# EAGLE design usv_50w_board (EAGLE 8.4.2)
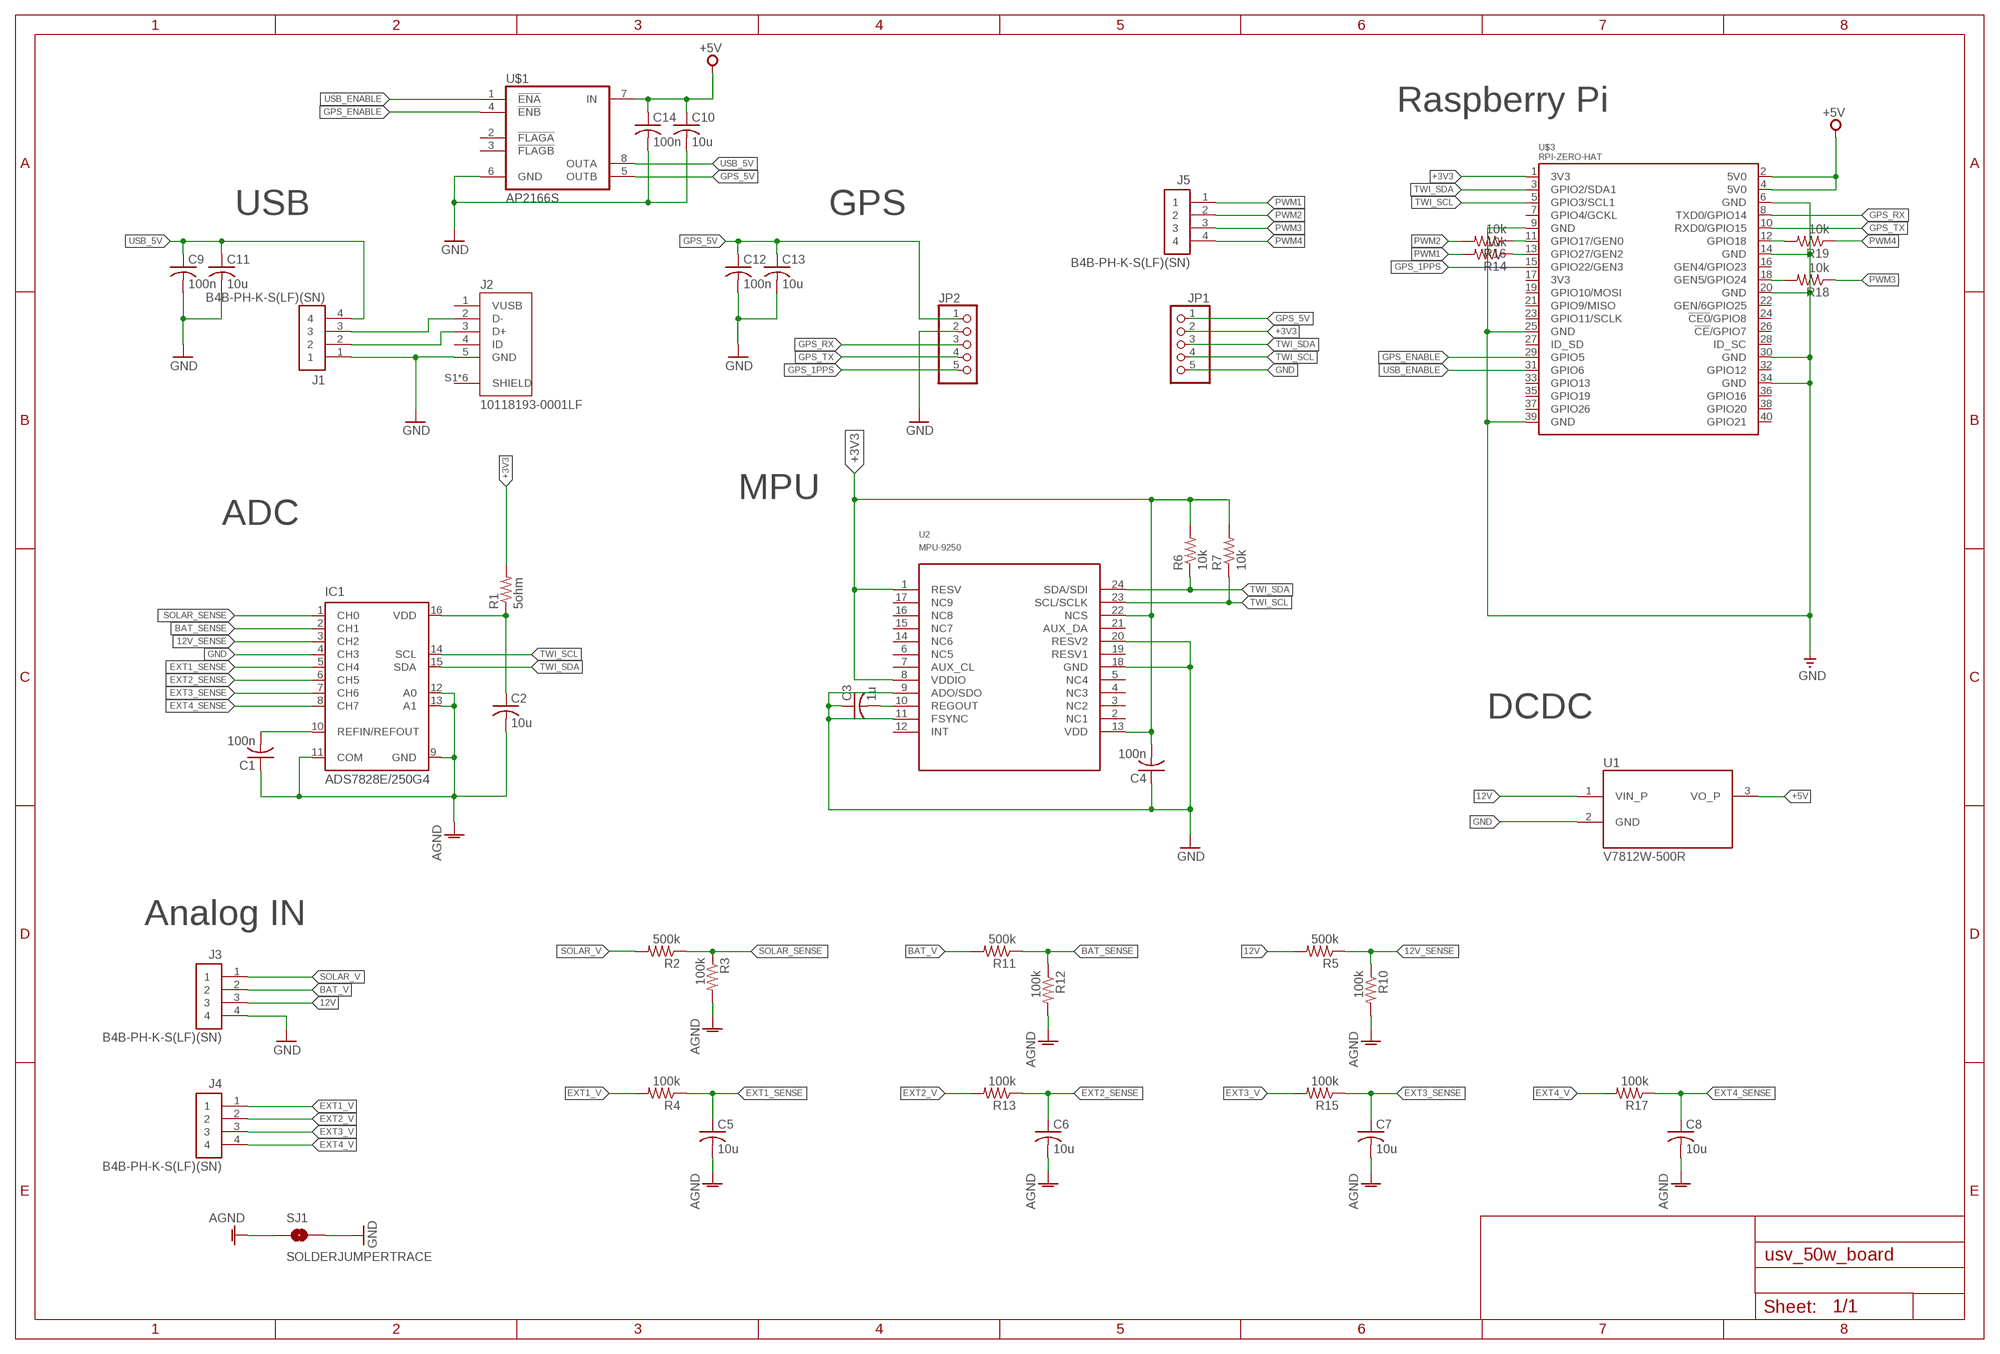
[diagram p0: schematic, sheet 1]

## Parts
C1  100n  C-USC0603  [C0603]
C2  10u  C-USC0603  [C0603]
C3  1u  C-USC0603  [C0603]
C4  100n  C-USC0603  [C0603]
C5  10u  C-USC0603  [C0603]
C6  10u  C-USC0603  [C0603]
C7  10u  C-USC0603  [C0603]
C8  10u  C-USC0603  [C0603]
C9  100n  C-USC0603  [C0603]
C10  10u  C-USC0603  [C0603]
C11  10u  C-USC0603  [C0603]
C12  100n  C-USC0603  [C0603]
C13  10u  C-USC0603  [C0603]
C14  100n  C-USC0603  [C0603]
IC1  ADS7828E/250G4  [TSSOP16-PW]
J1  B4B-PH-K-S(LF)(SN)  [JST_B4B-PH-K-S(LF)(SN)]
J2  10118193-0001LF  [FCI_10118193-0001LF]
J3  B4B-PH-K-S(LF)(SN)  [JST_B4B-PH-K-S(LF)(SN)]
J4  B4B-PH-K-S(LF)(SN)  [JST_B4B-PH-K-S(LF)(SN)]
J5  B4B-PH-K-S(LF)(SN)  [JST_B4B-PH-K-S(LF)(SN)]
JP1  PINHD-1X5  [1X05]
JP2  PINHD-1X5  [1X05]
R1  5ohm  R-US_R0603  [R0603]
R2  500k  R-US_R0603  [R0603]
R3  100k  R-US_R0603  [R0603]
R4  100k  R-US_R0603  [R0603]
R5  500k  R-US_R0603  [R0603]
R6  10k  R-US_R0603  [R0603]
R7  10k  R-US_R0603  [R0603]
R10  100k  R-US_R0603  [R0603]
R11  500k  R-US_R0603  [R0603]
R12  100k  R-US_R0603  [R0603]
R13  100k  R-US_R0603  [R0603]
R14  10k  R-US_R0603  [R0603]
R15  100k  R-US_R0603  [R0603]
R16  10k  R-US_R0603  [R0603]
R17  100k  R-US_R0603  [R0603]
R18  10k  R-US_R0603  [R0603]
R19  10k  R-US_R0603  [R0603]
SJ1  SOLDERJUMPERTRACE  [SJ_2S-TRACE]
U1  V7812W-500R  [CONV_V7812W-500R]
U2  MPU-9250  [LEAD-QFN24]
U$1  AP2166S  [SO08]
U$3  RPI-ZERO-HAT  [RASP_PI_ZERO_BOARD_FULL]

## Nets
12V: J3.3 R5.2 U1.1(VIN_P)
12V_SENSE: IC1.3(CH2) R5.1 R10.1
+3V3: C4.2 JP1.2 R1.2 R6.2 R7.2 U2.1(RESV) U2.8(VDDIO) U2.13(VDD) U2.22(NCS) U$3.1(3V3)
+5V [VCC]: C10.1 C14.1 U1.3(VO_P) U$1.7(IN) U$3.2(5V0) U$3.4(5V0)
AGND [GND]: C1.1 C2.2 C5.2 C6.2 C7.2 C8.2 IC1.9(GND) IC1.11(COM) IC1.12(A0) IC1.13(A1) R3.2 R10.2 R12.2 SJ1.1
BAT_SENSE: IC1.2(CH1) R11.1 R12.1
BAT_V: J3.2 R11.2
D_N: J1.3 J2.2(D-)
D_P: J1.2 J2.3(D+)
EXT1_SENSE: C5.1 IC1.5(CH4) R4.1
EXT1_V: J4.1 R4.2
EXT2_SENSE: C6.1 IC1.6(CH5) R13.1
EXT2_V: J4.2 R13.2
EXT3_SENSE: C7.1 IC1.7(CH6) R15.1
EXT3_V: J4.3 R15.2
EXT4_SENSE: C8.1 IC1.8(CH7) R17.1
EXT4_V: J4.4 R17.2
GND [GND]: C3.1 C4.1 C9.2 C10.2 C11.2 C12.2 C13.2 C14.2 IC1.4(CH3) J1.1 J2.5(GND) J3.4 JP1.5 JP2.2 SJ1.2 U1.2(GND) U2.9(ADO/SDO) U2.11(FSYNC) U2.18(GND) U2.20(RESV2) U$1.6(GND) U$3.6(GND) U$3.9(GND) U$3.14(GND) U$3.20(GND) U$3.25(GND) U$3.30(GND) U$3.34(GND) U$3.39(GND)
GPS_1PPS: JP2.5 U$3.15(GPIO22/GEN3)
GPS_5V [VCC]: C12.1 C13.1 JP1.1 JP2.1 U$1.5(OUTB)
GPS_ENABLE: U$1.4(!ENB!) U$3.29(GPIO5)
GPS_RX: JP2.3 U$3.8(TXD0/GPIO14)
GPS_TX: JP2.4 U$3.10(RXD0/GPIO15)
N$3: R14.1 U$3.13(GPIO27/GEN2)
N$4: C3.2 U2.10(REGOUT)
N$5: R16.1 U$3.11(GPIO17/GEN0)
N$6: R18.2 U$3.18(GEN5/GPIO24)
N$7: R19.2 U$3.12(GPIO18)
N$11: C2.1 IC1.16(VDD) R1.1
N$12: C1.2 IC1.10(REFIN/REFOUT)
PWM1: J5.1 R14.2
PWM2: J5.2 R16.2
PWM3: J5.3 R18.1
PWM4: J5.4 R19.1
SOLAR_SENSE: IC1.1(CH0) R2.1 R3.1
SOLAR_V: J3.1 R2.2
TWI_SCL: IC1.14(SCL) JP1.4 R7.1 U2.23(SCL/SCLK) U$3.5(GPIO3/SCL1)
TWI_SDA: IC1.15(SDA) JP1.3 R6.1 U2.24(SDA/SDI) U$3.3(GPIO2/SDA1)
USB_5V: C9.1 C11.1 J1.4 U$1.8(OUTA)
USB_ENABLE: U$1.1(!ENA!) U$3.31(GPIO6)
Unconnected: J2.1(VUSB) J2.4(ID) J2.S1(SHIELD) J2.S2(SHIELD) J2.S3(SHIELD) J2.S4(SHIELD) J2.S5(SHIELD) J2.S6(SHIELD) U2.2(NC1) U2.3(NC2) U2.4(NC3) U2.5(NC4) U2.6(NC5) U2.7(AUX_CL) U2.12(INT) U2.14(NC6) U2.15(NC7) U2.16(NC8) U2.17(NC9) U2.19(RESV1) U2.21(AUX_DA) U$1.2(!FLAGA!) U$1.3(!FLAGB!) U$3.7(GPIO4/GCKL) U$3.16(GEN4/GPIO23) U$3.17(3V3) U$3.19(GPIO10/MOSI) U$3.21(GPIO9/MISO) U$3.22(GEN/6GPIO25) U$3.23(GPIO11/SCLK) U$3.24(!CE0!/GPIO8) U$3.26(!CE!/GPIO7) U$3.27(ID_SD) U$3.28(ID_SC) U$3.32(GPIO12) U$3.33(GPIO13) U$3.35(GPIO19) U$3.36(GPIO16) U$3.37(GPIO26) U$3.38(GPIO20) U$3.40(GPIO21)

## Notes on the sheet
- Raspberry Pi
- USB | GPS | GPS
- MPU
- ADC
- DCDC
- Analog IN
- Hole

## Library data of the parts
C1-C14 = resistor:C-US: CAPACITOR, American symbol
IC1 = ADS7828E_250G4:ADS7828E/250G4: 12-Bit, 8-Channel Sampling ANALOG-TO-DIGITAL CONVERTER with I2C? Interface Source: www.ti.com .. ADS7828E/250G4.pdf; AVAILABILITY: Unavailable; DESCRIPTION: 12-Bit, 8-Channel SAR ADC with Internal Reference and I2C Interface 16-TSSOP -40 to 85; MF: Texas Instruments; MP: ADS7828E/250G4; PACKAGE: TSSOP-16 Texas Instruments; PRICE: None
J1 J3-J5 = B4B-PH-K-S_LF__SN_:B4B-PH-K-S(LF)(SN): PH Series 4 Position 2 mm Pitch Through Hole Crimp Top Entry Shrouded Header; DESCRIPTION: PH Series 4 Position 2 mm Pitch Through Hole Crimp Top Entry Shrouded Header; DIGI-KEY_PART_NUMBER: 455-1706-ND; DIGI-KEY_PURCHASE_URL: https://www.digikey.jp/product-detail/en/jst-sales-america-inc/B4B-PH-K-S_LF__SN_/455-1706-ND/926613?utm_source=snapeda&utm_medium=aggregator&utm_campaign=symbol; MF: JST Sales; MP: B4B-PH-K-S_LF__SN_; PACKAGE: None
J2 = 10118193-0001LF:10118193-0001LF: Micro USB B Type Receptacle; AVAILABILITY: Unavailable; DESCRIPTION: Single Port 5 Contact Shielded SMT MICRO USB B-Type Receptacle; MF: Amphenol FCI; MP: 10118193-0001LF; PACKAGE: None; PRICE: None
JP1 JP2 = pinhead+:PINHD-1X5: PIN HEADER
R1-R7 R10-R19 = resistor:R-US_: RESISTOR, American symbol
SJ1 = SparkFun-Retired:SOLDERJUMPER: Solder Jumper Standard SMD solder jumper. Used to automate production. Two varients : Normally Open and Normally Closed are the same, but have different paste layers. NC will have a large amount of paste and should jumper during reflow.
U1 = V7812W-500R:V7812W-500R; AVAILABILITY: Unavailable; CUI_PURCHASE_URL: https://www.cui.com/product/power/dc-dc-converters/non-isolated/0.5-a-output-current/v78w-500r-series?utm_source=snapeda.com&utm_medium=referral&utm_campaign=snapedaBOM; DESCRIPTION: V78W-500R Series 12 V 0.5 A Single Output Non-Isolated Switching Regulator; MF: CUI Inc.; MP: V7812W-500R; PACKAGE: SIP-3 CUI; PRICE: None
U2 = invensense:MPU-9250
U$1 = diodes-inc:AP2166: USB POWER SWITCH 1A DUAL CHANNEL CURRENT-LIMITED POWER SWITCH
U$3 = raspberrypi-zero:RPI-ZERO-HAT

## Net classes
1 GND: width 0.508 mm, drill 0.3 mm, clearance 0.2 mm to class 0, clearance 0.2 mm
2 100ohm_differencial_pair: width 0.254 mm, drill 0.3 mm, clearance 0.5 mm to class 0, clearance 0.5 mm to class 1, clearance 0.25 mm
3 90ohm_differencial_pair: width 0.254 mm, drill 0.3 mm, clearance 0.5 mm to class 0, clearance 0.5 mm to class 1, clearance 0.5 mm to class 2, clearance 0.15 mm
4 AGND: width 0.254 mm, drill 0.3 mm, clearance 0.5 mm to class 0, clearance 0.5 mm to class 1, clearance 0.5 mm to class 2, clearance 0.5 mm to class 3, clearance 0.5 mm
5 VCC: width 0.508 mm, drill 0.3 mm, clearance 0.3 mm to class 0, clearance 0.3 mm to class 1, clearance 0.5 mm to class 2, clearance 0.5 mm to class 3, clearance 0.5 mm to class 4, clearance 0.3 mm

## Board
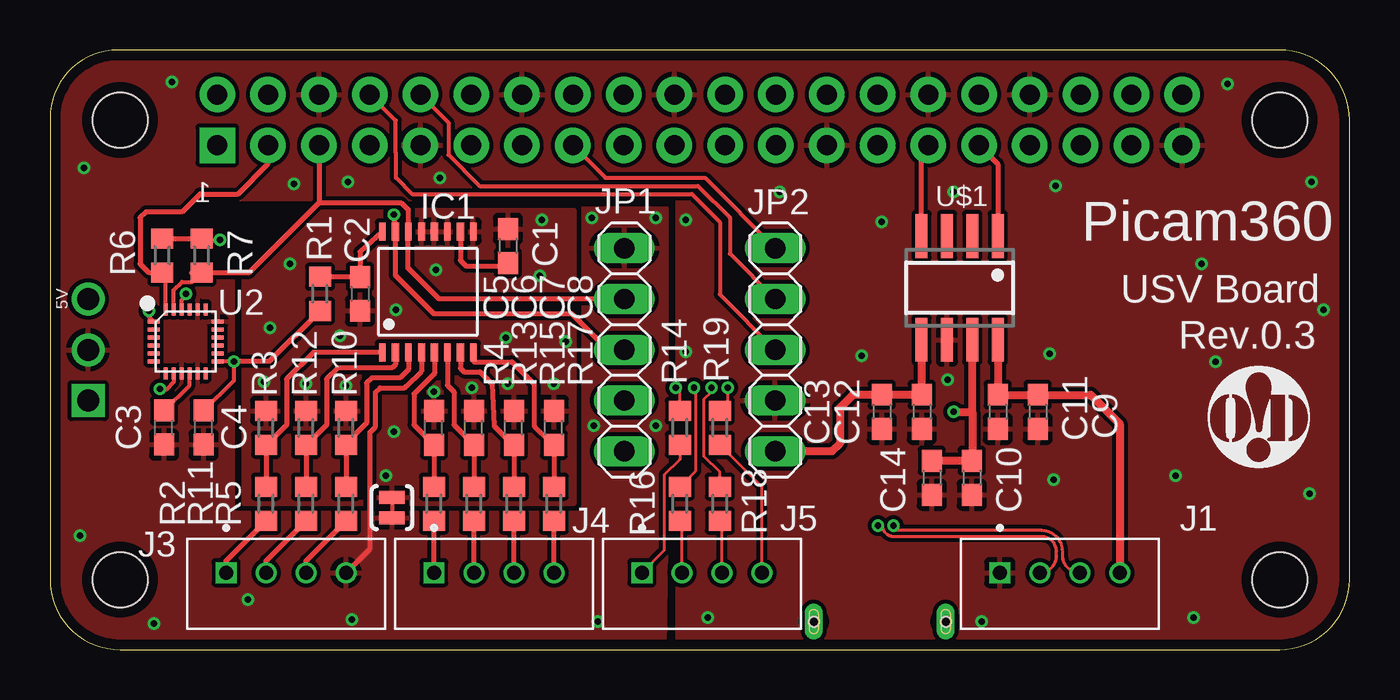
[diagram p1: board, top side]
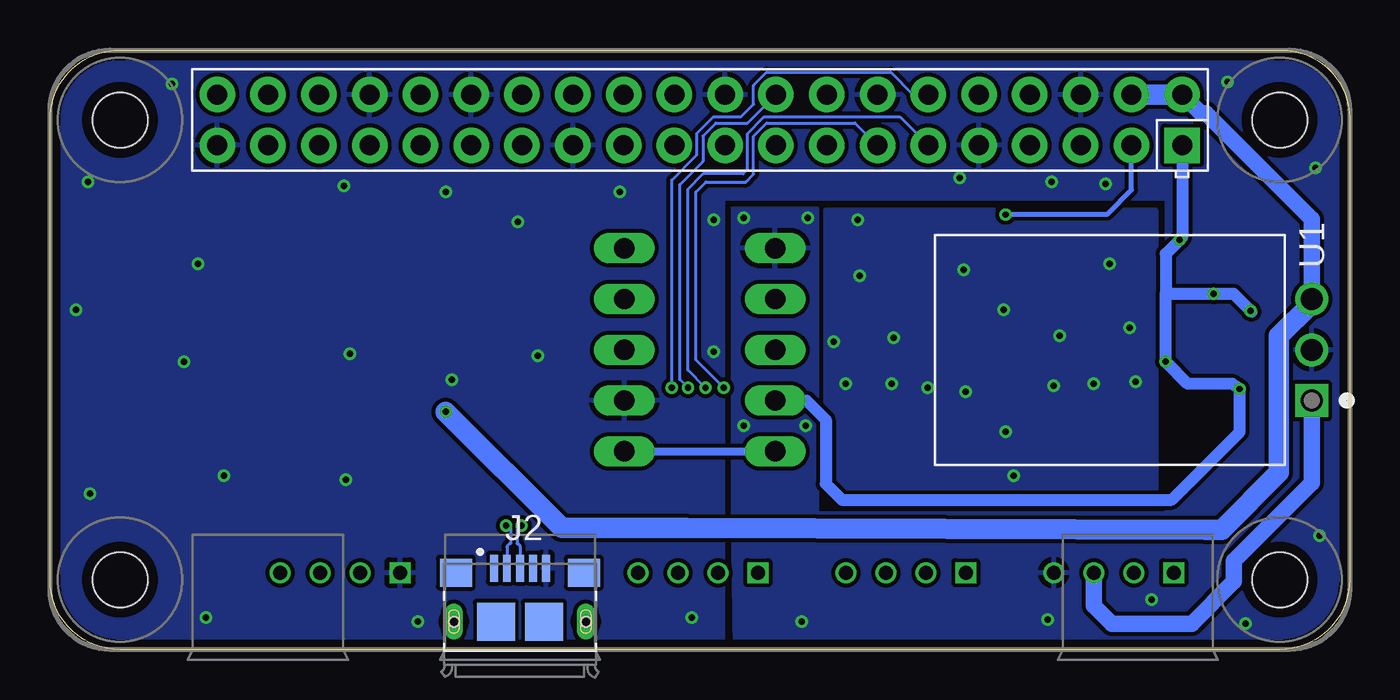
[diagram p2: board, bottom side, seen from below]

Size 65 x 30 mm. Coordinates in mm from the lower left corner, seen from the top.
Outline: 3.5,0 61.5,0 arc90 65,3.5 65,26.5 arc90 61.5,30 3.4,30 arc90 0,26.6 0,3.5 arc90 3.5,0
Copper layers (1*16): Top 0.035mm / dielectric 1.6mm / Bottom 0.035mm
Design rules "Elecrow_2-layer_PCB_eagle_rule": minimum track width 6mil, minimum drill 12mil, track to track 6mil, track to pad 6mil, pad to pad 6mil, via to via 8mil, smd to smd 0mil, copper to edge 20mil, drill to drill 10mil, minimum pad ring 6mil, minimum via ring 6mil, stop-mask expansion 0mil, vias tented up to drill 100mil, thermal gap 10mil

### Footprints (pad centres in the part's own frame; a part is rotated, then mirrored left to right if it is on the bottom)
C0603 = smd 1.1 x 1: 1 -0.85,0; 2 0.85,0
TSSOP16-PW = smd 0.35 x 0.9: 1 -2.275,-3.025; 2 -1.625,-3.025; 3 -0.975,-3.025; 4 -0.325,-3.025; 5 0.325,-3.025; 6 0.975,-3.025; 7 1.625,-3.025; 8 2.275,-3.025; 9 2.275,3.025; 10 1.625,3.025; 11 0.975,3.025; 12 0.325,3.025; 13 -0.325,3.025; 14 -0.975,3.025; 15 -1.625,3.025; 16 -2.275,3.025
JST_B4B-PH-K-S(LF)(SN) = drill 0.7 square: 1 3,-0.55 | drill 0.7: 2 1,-0.55; 3 -1,-0.55; 4 -3,-0.55
FCI_10118193-0001LF = smd 0.4 x 1.35: 1 -1.3,2.675; 2 -0.65,2.675; 3 0,2.675; 4 0.65,2.675; 5 1.3,2.675 | smd 1.6 x 1.4: S1 -3.2,2.45; S2 3.2,2.45 | smd 1.9 x 1.9: S3 1.2,0; S4 -1.2,0 | drill 0.5 pad 0.9 long: S5 -3.3,0; S6 3.3,0 | hole 0.5: -3.3,0; 3.3,0
1X05 = drill 1.016 long: 1 -5.08,0; 2 -2.54,0; 3 0,0; 4 2.54,0; 5 5.08,0
R0603 = smd 1 x 1.1: 1 -0.85,0; 2 0.85,0
SJ_2S-TRACE = smd 0.635 x 1.27: 1 -0.508,0; 2 0.508,0
CONV_V7812W-500R = drill 1.1 square: 1 -10.1,2.54 | drill 1.1: 2 -10.1,0; 3 -10.1,-2.54
LEAD-QFN24 = smd 0.6 x 0.2: 1 -1.6,1; 2 -1.6,0.6; 3 -1.6,0.2; 4 -1.6,-0.2; 5 -1.6,-0.6; 6 -1.6,-1; 13 1.6,-1; 14 1.6,-0.6; 15 1.6,-0.2; 16 1.6,0.2; 17 1.6,0.6; 18 1.6,1 | smd 0.2 x 0.6: 7 -1,-1.6; 8 -0.6,-1.6; 9 -0.2,-1.6; 10 0.2,-1.6; 11 0.6,-1.6; 12 1,-1.6; 19 1,1.6; 20 0.6,1.6; 21 0.2,1.6; 22 -0.2,1.6; 23 -0.6,1.6; 24 -1,1.6
SO08 = smd 0.6 x 2.2: 1 -1.905,-2.6; 2 -0.635,-2.6; 3 0.635,-2.6; 4 1.905,-2.6; 5 1.905,2.6; 6 0.635,2.6; 7 -0.635,2.6; 8 -1.905,2.6
RASP_PI_ZERO_BOARD_FULL = drill 1 pad 1.778 square: 1 8.37,25.23 | drill 1 pad 1.778: 2 8.37,27.77; 3 10.91,25.23; 4 10.91,27.77; 5 13.45,25.23; 6 13.45,27.77; 7 15.99,25.23; 8 15.99,27.77; 9 18.53,25.23; 10 18.53,27.77; 11 21.07,25.23; 12 21.07,27.77; 13 23.61,25.23; 14 23.61,27.77; 15 26.15,25.23; 16 26.15,27.77; 17 28.69,25.23; 18 28.69,27.77; 19 31.23,25.23; 20 31.23,27.77; 21 33.77,25.23; 22 33.77,27.77; 23 36.31,25.23; 24 36.31,27.77; 25 38.85,25.23; 26 38.85,27.77; 27 41.39,25.23; 28 41.39,27.77; 29 43.93,25.23; 30 43.93,27.77; 31 46.47,25.23; 32 46.47,27.77; 33 49.01,25.23; 34 49.01,27.77; 35 51.55,25.23; 36 51.55,27.77; 37 54.09,25.23; 38 54.09,27.77; 39 56.63,25.23; 40 56.63,27.77 | hole 2.75: 3.5,3.5; 3.5,26.5; 61.5,3.5; 61.5,26.5

### Placement (x,y rotation side)
C1  22.9,20.2 270 top
C2  15.5,17.8 270 top
C3  5.71,11.1 90 top
C4  7.68,11.1 90 top
C5  19.2,11.1 90 top
C6  21.2,11.1 90 top
C7  23.2,11.1 90 top
C8  25.2,11.1 90 top
C9  49.4,11.9 270 top
C10  46.1,8.6 270 top
C11  47.4,11.9 270 top
C12  43.6,11.9 270 top
C13  41.6,11.9 270 top
C14  44.1,8.6 270 top
IC1  18.9,17.9 0 top
J1  50.5,3.3 180 top
J2  41.5,1.4 0 bottom
J3  11.8,3.3 180 top
J4  22.2,3.3 180 top
J5  32.6,3.3 180 top
JP1  28.73,15 90 top
JP2  36.27,15 90 top
LOGO1  [OHMYDIGIFAB_LOGO]  60.47,11.59 0 top
R1  13.5,17.8 270 top
R2  10.8,7.3 270 top
R3  10.8,11.1 90 top
R4  19.2,7.3 270 top
R5  14.8,7.3 270 top
R6  5.61,19.72 90 top
R7  7.58,19.72 90 top
R10  14.8,11.1 90 top
R11  12.8,7.3 270 top
R12  12.8,11.1 90 top
R13  21.2,7.3 270 top
R14  31.5,11.1 270 top
R15  23.2,7.3 270 top
R16  31.5,7.3 270 top
R17  25.2,7.3 270 top
R18  33.5,7.3 90 top
R19  33.5,11.1 90 top
SJ1  17.1,7.1 270 top
U1  12,15 180 bottom
U2  6.78,15.42 0 top
U$1  45.5,18.1 180 top
U$3  0,0 0 top

### Tracks (layer width: path | path; a pad name or v marks a point on that pad's centre or on a via)
12V
  Top 0.254: J3.3 12.8,4.45 R5.2
  Bottom 0.813: J3.3 12.8,2.2 11.9,1.3 7.9,1.3 5.79,3.41 5.79,4.45 1.9,8.34 U1.1
12V_SENSE
  Top 0.254: R5.1 R10.1 15,10.51 15.83,11.33 15.83,13.33 16.1,13.6 17.5,13.6 17.93,14.03 IC1.3
+3V3  (via drill 0.3)
  Top 0.2: U2.13 v9.2,14.42 9.2,13.47 C4.2
  Top 0.203: U2.22 6.58,17.48 6.8,17.7 v6.8,17.8 | U2.8 6.18,13.38 5.8,13 5.6,13.03 v5.5,13.03 | U2.1 4.95,16.64 v4.95,16.95
  Top 0.254: 7.58,20.5 R7.2 | 7.58,20.5 v8.5,20.5 | R1.2 10.97,14.42 v9.2,14.42 | R6.2 7.51,20.57 7.58,20.5
  Bottom 0.203: 9.2,14.4 v9.2,14.42
  Bottom 0.61: 9.2,17.8 9.2,19.8 v8.5,20.5 8.37,20.63 U$3.1 | 9.2,17.8 v9.2,14.42 8.08,13.3 5.87,13.3 v5.5,13.03 5.5,10.9 8.9,7.5 25.4,7.5 26.2,8.3 26.2,11.5 27.16,12.46 JP1.2 | 9.2,17.8 v6.8,17.8 5.8,17.8 v4.95,16.95 4.9,16.9
+5V  (via drill 0.3)
  Top 0.406: C14.1 C10.1 46.13,9.52 46.13,11.9 | 46.13,11.9 U$1.7 | v45.2,11.9 46.13,11.9
  Bottom 0.813: U$3.2 7.42,26.82 7.19,26.82 1.9,21.54 U1.3
  Bottom 1.016: U$3.2 U$3.4 | U1.3 1.9,17.31 3.53,15.68 3.53,8.87 6.4,6 7.2,6 33.2,6.1 39.4,6.1 v45.2,11.9
AGND  (via drill 0.3)
  other vias: 22.9,13.3 21.1,13.1 19.2,12.9 14.8,13.2 12.8,13.3 10.7,13.4 25.2,13.3 16.8,8.7 17.2,10.9 14.5,15.7 11,16.1 12,19.3 17.3,17 19.3,19 22.8,15.6 25.8,15.4 24.6,21.5 24.5,18.7
  pour Bottom: 9.7,22 9.7,7.3 26.2,7.3 26.2,22
  pour Top: 26.2,22 26.2,7.3 9.7,7.3 9.7,22
BAT_SENSE
  Top 0.254: R11.1 R12.1 13,10.4 13.83,11.23 13.83,13.53 14.4,14.1 17.1,14.1 17.27,14.28 IC1.2
BAT_V
  Top 0.254: J3.2 10.8,4.45 R11.2
D_N  (via drill 0.3)
  Top 0.152: J1.3 arc-90 50.65,4.7 50.65,4.9 arc90 49.6,5.95 42.2,5.95 arc-90 41.95,6.2 v42.18,6.2
  Bottom 0.152: v42.18,6.2 41.95,6.2 41.95,5.3 arc-90 42.15,5.1 J2.2
D_P  (via drill 0.3)
  Top 0.152: J1.2 arc90 50.35,4.7 50.35,4.9 arc90 49.6,5.65 42.2,5.65 arc-90 41.65,6.2 v41.42,6.2
  Bottom 0.152: v41.42,6.2 41.65,6.2 41.65,5.3 arc90 41.5,5.15 J2.3
EXT1_SENSE
  Top 0.254: R4.1 C5.1 18.2,11.25 18.2,12.8 19.23,13.82 IC1.5
EXT1_V
  Top 0.254: J4.1 R4.2
EXT2_SENSE
  Top 0.254: IC1.6 19.88,13.22 20.2,12.9 20.2,11.25 C6.1 R13.1
EXT2_V
  Top 0.254: J4.2 R13.2
EXT3_SENSE
  Top 0.254: C7.1 R15.1 | IC1.7 20.52,14.07 20.7,13.9 21.5,13.9 22.12,13.28 22.22,11.18 23.16,10.25 C7.1 | 23.2,10.51 C7.1
EXT3_V
  Top 0.254: J4.3 R15.2
EXT4_SENSE
  Top 0.254: R17.1 C8.1 25,10.4 24.22,11.18 24.22,13.28 23.1,14.4 21.2,14.4 IC1.8
EXT4_V
  Top 0.254: J4.4 R17.2
GND  (via drill 0.3)
  Top 0.254: IC1.4 18.57,13.92 17.85,13.19 17.73,13.1 16.5,13.1 16.28,12.88 16.28,11.15 16,10.86 16,5.05 J3.4
  other vias: 27.1,21.6 30.3,21.6 31.8,14.9 31.8,21.5 14.9,23.4 19.5,23.6 12.2,23.3 6.1,28.4 1.7,24.1 1.5,5.7 5.2,1.3 9.9,2.5 15.1,1.5 27.4,1.4 32.9,1.6 46.6,1.4 57.2,1.6 63,7.8 56.3,8.7 50.2,8.5 40.6,14.7 36.5,22.9 41.6,21.4 45.2,22.9 50.3,23.2 50,14.8 58.9,28.3 63.1,23.4 57.6,19.3 58.3,14.4 63.7,17 30.3,11.2 27.2,11.2 44.9,13.5
  pour Top: 0,0 30.8,0 30.9,6.9 30.9,22.1 26.6,22.1 26.6,6.9 9.2,6.9 9.2,22.5 31.3,22.5 31.3,0 65,0 65,30 0,30
  pour Bottom: 0,0 30.8,0 30.9,6.9 30.9,22.1 26.6,22.1 26.6,6.9 9.2,6.9 9.2,22.5 31.3,22.5 31.3,0 65,0 65,30 0,30
GPS_1PPS
  Top 0.2: U$3.15 27.78,23.6 32.75,23.6 JP2.5
GPS_5V
  Top 0.406: U$1.5 C12.1 C13.1 40.15,12.75 39.5,12.1 39.5,10.3 39.12,9.92 JP2.1
  Bottom 0.406: JP2.1 JP1.1
GPS_ENABLE
  Top 0.254: U$1.4 43.59,24.89 U$3.29
GPS_RX
  Top 0.2: U$3.8 17.29,26.47 17.29,24.86 17.3,24.85 17.3,23.6 18.1,22.8 32.1,22.8 33.5,21.4 33.5,17.77 JP2.3
GPS_TX
  Top 0.2: U$3.10 19.93,26.37 19.93,24.76 21.49,23.2 32.4,23.2 34,21.6 34,19.81 JP2.4
N$3  (via drill 0.3)
  Top 0.152: R14.1 31.5,12.9 v31.3,13.1
  Bottom 0.152: U$3.13 24.73,26.35 29.15,26.35 29.81,25.69 29.81,23.79 30.2,23.4 32.2,23.4 32.7,22.9 32.7,14.5 v31.3,13.1
N$4
  Top 0.2: C3.2 6.98,13.22 U2.10
N$5  (via drill 0.3)
  Top 0.152: R16.1 32.3,8.95 32.3,13.1 v32.21,13.1
  Bottom 0.152: U$3.11 22.49,26.65 29.28,26.65 30.11,25.82 30.11,24.02 30.33,23.8 32.33,23.8 33.1,23.03 33.1,13.99 v32.21,13.1
N$6  (via drill 0.3)
  Top 0.152: R18.2 33.5,8.88 32.72,9.65 32.72,12.54 33.1,12.92 v33.1,13.1 v33.09,13.1
  Bottom 0.152: U$3.18 30.11,26.35 31.69,26.35 32.35,25.69 32.35,24.41 33.49,23.27 33.49,14.5 | 33.49,14.5 33.49,14.49 | v33.09,13.1 33.49,13.51 33.49,14.5
N$7  (via drill 0.3)
  Top 0.152: R19.2 33.9,12.35 v33.9,13.1
  Bottom 0.152: U$3.12 21.83,27.77 22.95,28.89 29.15,28.89 29.81,28.23 29.81,27.29 30.44,26.65 31.82,26.65 32.65,25.82 32.65,24.74 33.9,23.49 v33.9,13.1
N$11
  Top 0.254: R1.1 C2.1 15.5,19.9 IC1.16
N$12
  Top 0.254: IC1.10 20.52,19.48 20.8,19.2 22.95,19.2 C1.2
PWM1
  Top 0.152: R14.2 31.5,9.52 30.72,8.74 30.72,4.97 J5.1
PWM2
  Top 0.152: J5.2 31.6,6.35 R16.2
PWM3
  Top 0.152: J5.3 33.6,6.35 R18.1
PWM4
  Top 0.152: J5.4 35.6,8.15 R19.1
SOLAR_SENSE
  Top 0.254: 10.8,10.21 R2.1 | IC1.1 13.18,14.88 11.83,13.53 11.83,11.23 10.8,10.21 | 10.8,10.21 R3.1
SOLAR_V
  Top 0.254: J3.1 8.8,4.45 R2.2
TWI_SCL
  Top 0.2: R7.1 7.55,18.84 7.05,18.84
  Top 0.203: U2.23 6.18,17.98 6.6,18.4 7.11,18.4 7.55,18.84
  Top 0.254: R7.1 9.97,18.87 13.45,22.35 | U$3.5 13.45,22.35 | 13.45,22.35 17.55,22.35 17.93,21.98 IC1.14 17.9,20.4 17.9,19.1 19.46,17.54 JP1.4
TWI_SDA  (via drill 0.3)
  Top 0.2: R6.1 5.78,18.71 U2.24
  Top 0.254: JP1.3 27.9,15 26.1,16.8 19.2,16.8 17.27,18.73 IC1.15 17.3,20.45 17.3,21.3 17.23,21.37 v17.2,21.77 | U$3.3 10.91,24.31 9.4,22.8 7.5,22.8 6.6,21.9 4.8,21.9 4.5,21.6 4.5,19.3 4.93,18.87 R6.1
  Bottom 0.254: v17.2,21.77 17.17,21.8 12.1,21.8 10.91,22.99 U$3.3
USB_5V
  Top 0.406: J1.4 53.5,11.3 52.05,12.75 C9.1 C11.1 U$1.8
USB_ENABLE
  Top 0.254: U$3.31 47.41,24.3 U$1.1

### Text on the board
tPlace: Picam360 | USV Board | 5V | Rev.0.3